# EAGLE design Balancer (EAGLE 6.5.0)
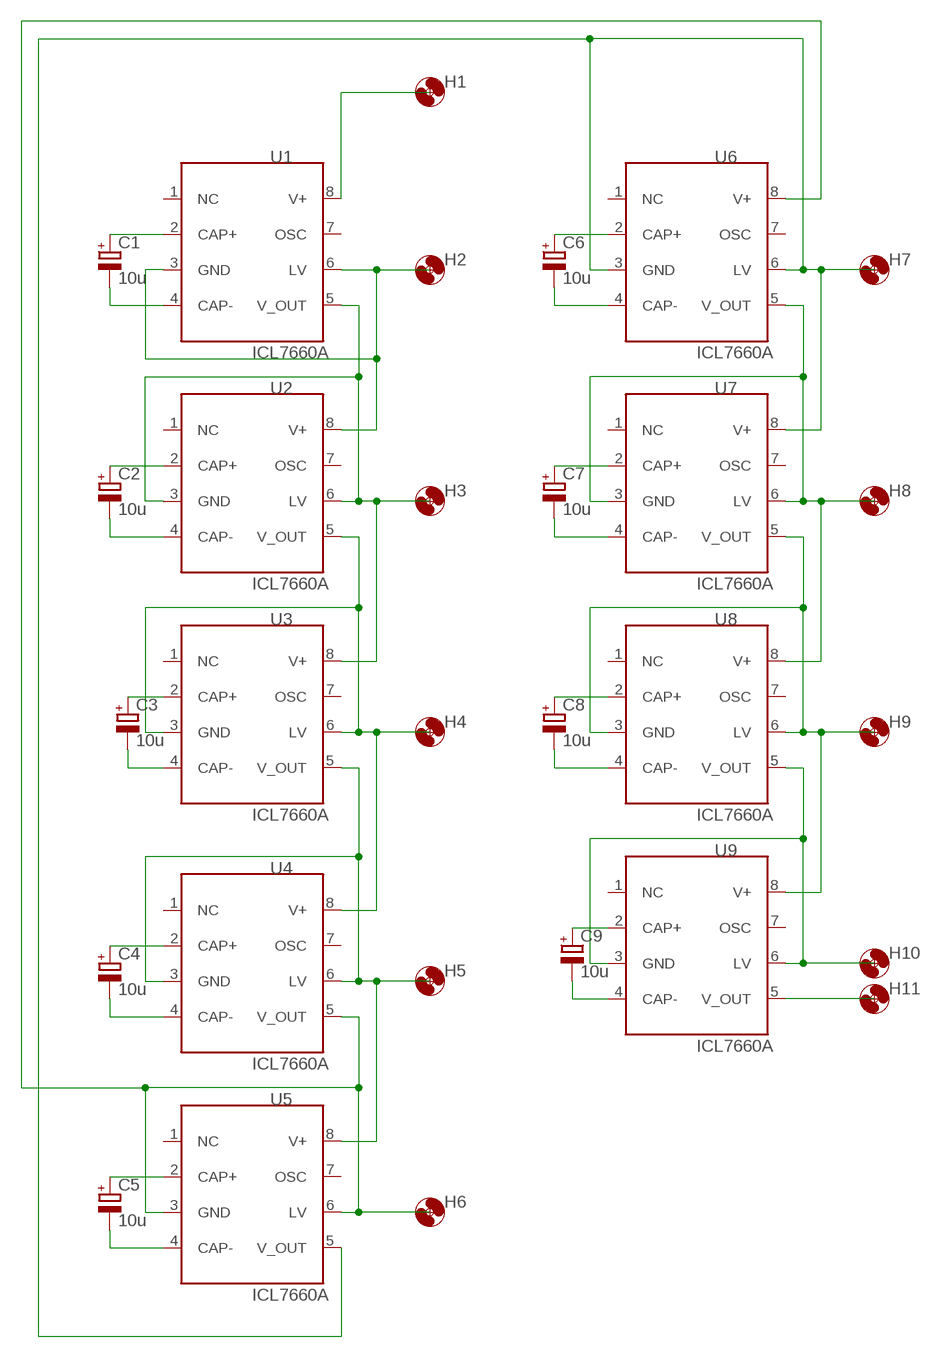
[diagram p0: schematic, sheet 1]

## Parts
C1  10u  CPOL-EUCT3216  [CT3216]
C2  10u  CPOL-EUCT3216  [CT3216]
C3  10u  CPOL-EUCT3216  [CT3216]
C4  10u  CPOL-EUCT3216  [CT3216]
C5  10u  CPOL-EUCT3216  [CT3216]
C6  10u  CPOL-EUCT3216  [CT3216]
C7  10u  CPOL-EUCT3216  [CT3216]
C8  10u  CPOL-EUCT3216  [CT3216]
C9  10u  CPOL-EUCT3216  [CT3216]
H1  MOUNT-HOLE3.0  [3,0]
H2  MOUNT-HOLE3.0  [3,0]
H3  MOUNT-HOLE3.0  [3,0]
H4  MOUNT-HOLE3.0  [3,0]
H5  MOUNT-HOLE3.0  [3,0]
H6  MOUNT-HOLE3.0  [3,0]
H7  MOUNT-HOLE3.0  [3,0]
H8  MOUNT-HOLE3.0  [3,0]
H9  MOUNT-HOLE3.0  [3,0]
H10  MOUNT-HOLE3.0  [3,0]
H11  MOUNT-HOLE3.0  [3,0]
U1  ICL7660A  [SO08]
U2  ICL7660A  [SO08]
U3  ICL7660A  [SO08]
U4  ICL7660A  [SO08]
U5  ICL7660A  [SO08]
U6  ICL7660A  [SO08]
U7  ICL7660A  [SO08]
U8  ICL7660A  [SO08]
U9  ICL7660A  [SO08]

## Nets
N$1: C1.+ U1.2(CAP+)
N$2: C1.- U1.4(CAP-)
N$3: C2.+ U2.2(CAP+)
N$4: C2.- U2.4(CAP-)
N$5: C3.+ U3.2(CAP+)
N$6: C3.- U3.4(CAP-)
N$7: C4.+ U4.2(CAP+)
N$8: C4.- U4.4(CAP-)
N$9: C5.+ U5.2(CAP+)
N$10: C5.- U5.4(CAP-)
N$11: C6.+ U6.2(CAP+)
N$12: C6.- U6.4(CAP-)
N$13: C7.+ U7.2(CAP+)
N$14: C7.- U7.4(CAP-)
N$15: C8.+ U8.2(CAP+)
N$16: C8.- U8.4(CAP-)
N$17: C9.+ U9.2(CAP+)
N$18: C9.- U9.4(CAP-)
N$19: H1.P$1 U1.8(V+)
N$20: H2.P$1 U1.3(GND) U1.6(LV) U2.8(V+)
N$22: H3.P$1 U1.5(V_OUT) U2.3(GND) U2.6(LV) U3.8(V+)
N$25: H4.P$1 U2.5(V_OUT) U3.3(GND) U3.6(LV) U4.8(V+)
N$26: H5.P$1 U3.5(V_OUT) U4.3(GND) U4.6(LV) U5.8(V+)
N$27: H6.P$1 U4.5(V_OUT) U5.3(GND) U5.6(LV) U6.8(V+)
N$28: H7.P$1 U5.5(V_OUT) U6.3(GND) U6.6(LV) U7.8(V+)
N$29: H8.P$1 U6.5(V_OUT) U7.3(GND) U7.6(LV) U8.8(V+)
N$30: H9.P$1 U7.5(V_OUT) U8.3(GND) U8.6(LV) U9.8(V+)
N$31: H10.P$1 U8.5(V_OUT) U9.3(GND) U9.6(LV)
N$37: H11.P$1 U9.5(V_OUT)
Unconnected: U1.1(NC) U1.7(OSC) U2.1(NC) U2.7(OSC) U3.1(NC) U3.7(OSC) U4.1(NC) U4.7(OSC) U5.1(NC) U5.7(OSC) U6.1(NC) U6.7(OSC) U7.1(NC) U7.7(OSC) U8.1(NC) U8.7(OSC) U9.1(NC) U9.7(OSC)

## Library data of the parts
C1-C9 = rcl:CPOL-EU: POLARIZED CAPACITOR, European symbol
H1-H11 = holes:MOUNT-HOLE: MOUNTING HOLE with drill center marker
U1-U9 = usb:ICL7660A

## Board
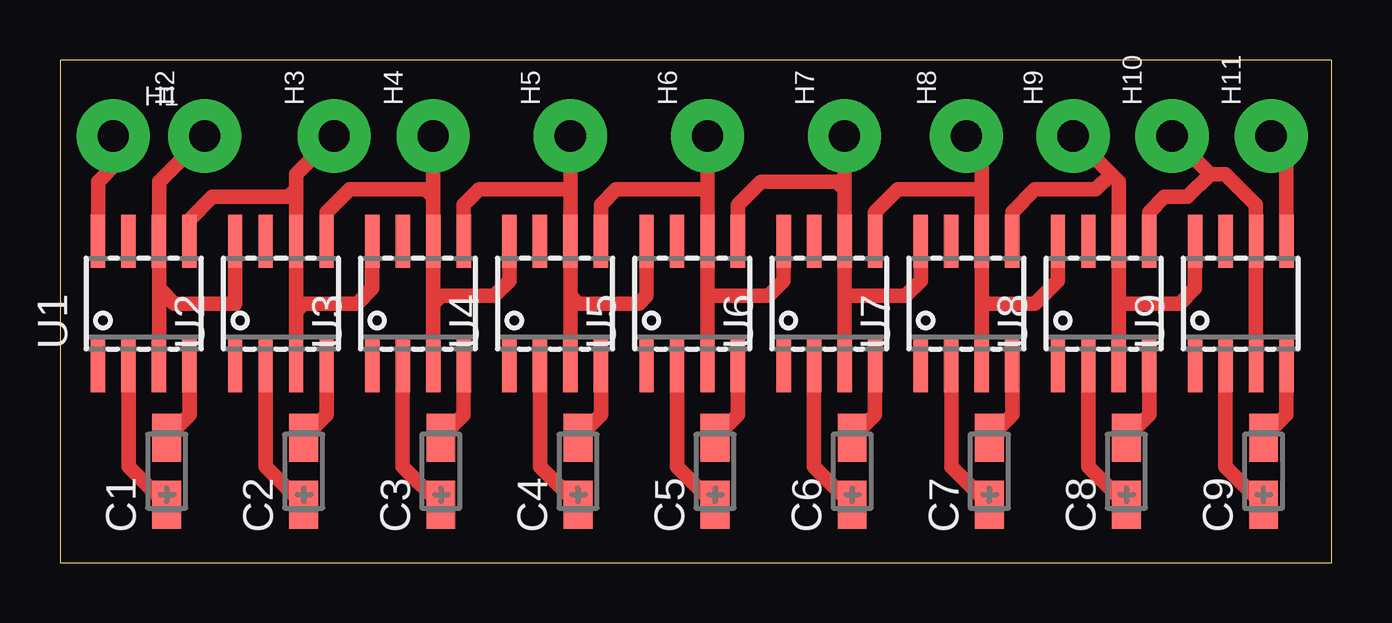
[diagram p1: board, top side]

Size 53.01 x 20.95 mm. Coordinates in mm from the lower left corner, seen from the top.
Outline: 0,0 53.01,0 53.01,20.95 0,20.95 0,0
Copper layers (1*16): Top 0.035mm / dielectric 1.5mm / Bottom 0.035mm
Design rules "default": minimum track width 12mil, minimum drill 32mil, track to track 12mil, track to pad 12mil, pad to pad 12mil, via to via 12mil, smd to smd 8mil, copper to edge 40mil, drill to drill 8mil, minimum pad ring 16mil, minimum via ring 12mil, stop-mask expansion 4mil, vias tented up to drill 0mil, thermal gap 20mil

### Footprints (pad centres in the part's own frame; a part is rotated, then mirrored left to right if it is on the bottom)
CT3216 = smd 2 x 1.2: + -1.4,0; - 1.4,0
3,0 = drill 1.3 pad 3.048: P$1 0,0
SO08 = smd 0.6 x 2.2: 1 -1.905,-2.6; 2 -0.635,-2.6; 3 0.635,-2.6; 4 1.905,-2.6; 5 1.905,2.6; 6 0.635,2.6; 7 -0.635,2.6; 8 -1.905,2.6

### Placement (x,y rotation side)
C1  4.45,3.81 90 top
C2  10.16,3.81 90 top
C3  15.88,3.81 90 top
C4  21.59,3.81 90 top
C5  27.3,3.81 90 top
C6  33.02,3.81 90 top
C7  38.73,3.81 90 top
C8  44.45,3.81 90 top
C9  50.16,3.81 90 top
H1  2.22,17.78 0 top
H2  6.03,17.78 90 top
H3  11.43,17.78 90 top
H4  15.56,17.78 90 top
H5  21.27,17.78 90 top
H6  26.99,17.78 90 top
H7  32.7,17.78 90 top
H8  37.78,17.78 90 top
H9  42.23,17.78 90 top
H10  46.35,17.78 90 top
H11  50.48,17.78 90 top
U1  3.49,10.79 0 top
U2  9.21,10.79 0 top
U3  14.92,10.79 0 top
U4  20.64,10.79 0 top
U5  26.35,10.79 0 top
U6  32.07,10.79 0 top
U7  37.78,10.79 0 top
U8  43.5,10.79 0 top
U9  49.21,10.79 0 top

### Tracks (layer width: path | path; a pad name or v marks a point on that pad's centre or on a via)
N$1
  Top 0.61: C1.+ 2.86,4 U1.2
N$2
  Top 0.61: C1.- 5.4,6.16 U1.4
N$3
  Top 0.61: C2.+ 8.57,4 U2.2
N$4
  Top 0.61: C2.- 11.11,6.16 U2.4
N$5
  Top 0.61: C3.+ 14.29,4 U3.2
N$6
  Top 0.61: C3.- 16.83,6.16 U3.4
N$7
  Top 0.61: C4.+ 20,4 U4.2
N$8
  Top 0.61: C4.- 22.54,6.16 U4.4
N$9
  Top 0.61: C5.+ 25.72,4 U5.2
N$10
  Top 0.61: C5.- 28.26,6.16 U5.4
N$11
  Top 0.61: C6.+ 31.43,4 U6.2
N$12
  Top 0.61: C6.- 33.97,6.16 U6.4
N$13
  Top 0.61: C7.+ 37.15,4 U7.2
N$14
  Top 0.61: C7.- 39.69,6.16 U7.4
N$15
  Top 0.61: C8.+ 42.86,4 U8.2
N$16
  Top 0.61: C8.- 45.4,6.16 U8.4
N$17
  Top 0.61: C9.+ 48.58,4 U9.2
N$18
  Top 0.61: C9.- 51.12,6.16 U9.4
N$19
  Top 0.61: H1.P$1 2.22,16.51 1.59,15.88 U1.8
N$20
  Top 0.61: 4.13,11.43 U1.6 4.13,15.88 H2.P$1 | 4.13,11.43 U1.3 | U2.8 7.3,10.79 4.76,10.79 4.13,11.43
N$22
  Top 0.61: 9.84,10.48 U2.6 9.84,15.56 | 9.84,10.48 U2.3 | U3.8 13.02,11.43 12.38,10.79 10.16,10.79 9.84,10.48 | 9.84,15.56 9.84,16.19 H3.P$1 | U1.5 5.4,14.29 6.35,15.24 9.53,15.24 9.84,15.56
N$25
  Top 0.61: 15.56,10.79 U3.6 15.56,15.24 | 15.56,10.79 U3.3 | U4.8 18.73,11.75 18.1,11.11 15.88,11.11 15.56,10.79 | H4.P$1 15.56,15.24 | U2.5 11.11,14.61 12.06,15.56 15.24,15.56 15.56,15.24
N$26
  Top 0.61: H5.P$1 21.27,15.56 | 21.27,15.56 U4.6 21.27,11.11 | U3.5 16.83,14.92 17.46,15.56 21.27,15.56 | 21.27,11.11 U4.3 | U5.8 24.45,11.11 24.13,10.79 21.59,10.79 21.27,11.11
N$27
  Top 0.61: 26.99,11.11 U5.6 26.99,15.56 | 26.99,11.11 U5.3 | U6.8 30.16,11.75 29.53,11.11 26.99,11.11 | 26.99,15.56 H6.P$1 | U4.5 22.54,14.92 23.18,15.56 26.99,15.56
N$28
  Top 0.61: 32.7,11.11 U6.6 32.7,15.56 | 32.7,11.11 U6.3 | U7.8 35.88,11.75 35.24,11.11 32.7,11.11 | 32.7,15.56 H7.P$1 | U5.5 28.26,14.92 29.21,15.88 32.38,15.88 32.7,15.56
N$29
  Top 0.61: 38.42,10.79 U7.6 38.42,15.56 | 38.42,10.79 U7.3 | U8.8 41.59,11.75 40.64,10.79 38.42,10.79 | 38.42,15.56 38.42,17.14 H8.P$1 | U6.5 33.97,14.61 34.92,15.56 38.42,15.56
N$30
  Top 0.61: 44.13,10.79 U8.6 44.13,15.88 43.81,16.19 | 44.13,10.79 U8.3 | U9.8 47.31,11.43 46.67,10.79 44.13,10.79 | 43.81,16.19 H9.P$1 | U7.5 39.69,14.61 40.64,15.56 43.18,15.56 43.81,16.19
N$31
  Top 0.61: U9.3 U9.6 49.85,14.92 48.58,16.19 47.94,16.19 | 47.94,16.19 H10.P$1 | U8.5 45.4,14.61 46.04,15.24 46.99,15.24 47.94,16.19
N$37
  Top 0.61: U9.5 51.12,17.14 H11.P$1